# EAGLE schematic scematic (EAGLE 7.1.0)
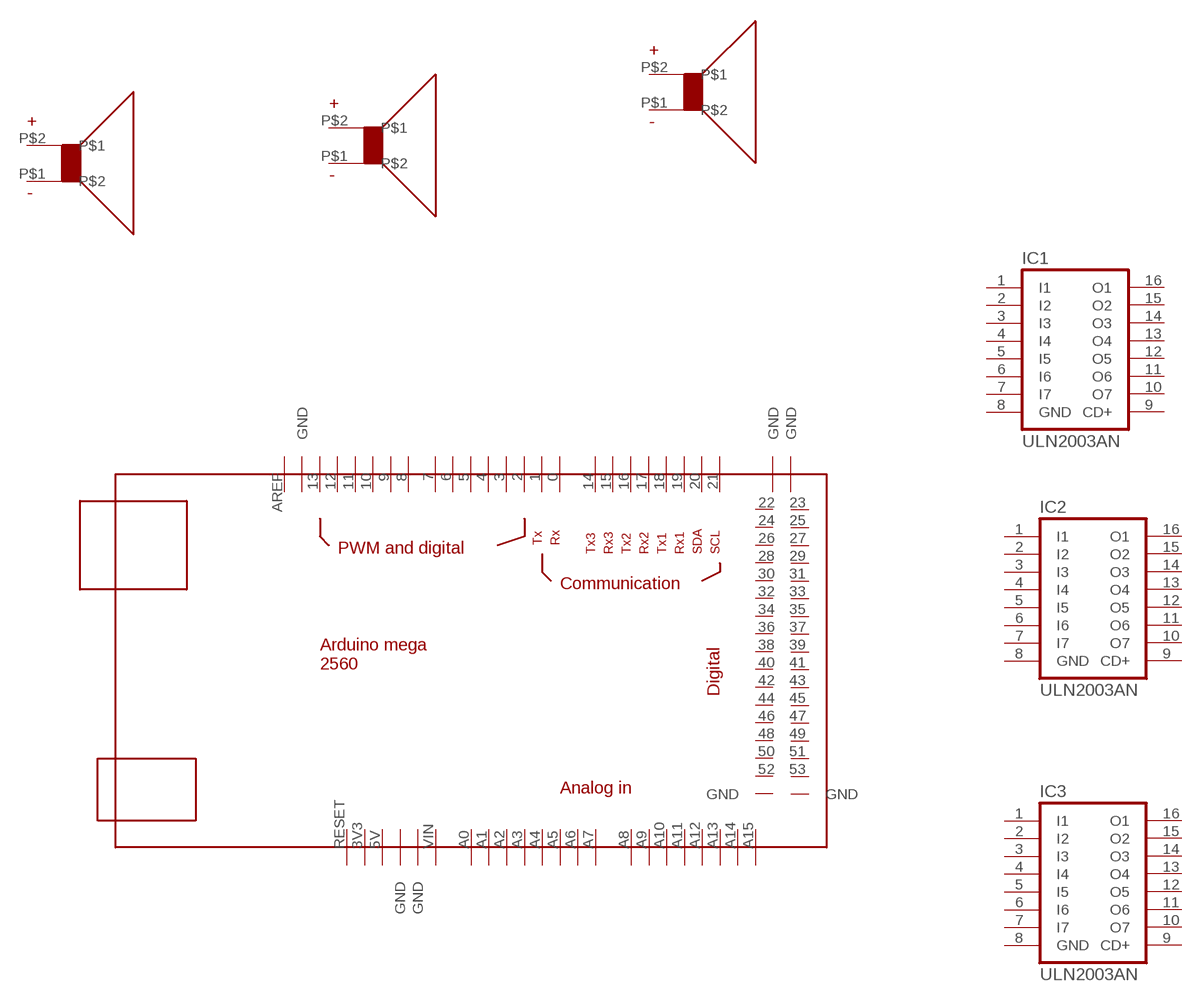
[diagram p0: schematic, sheet 1]

## Parts
IC1  ULN2003AN  [DIL16]
IC2  ULN2003AN  [DIL16]
IC3  ULN2003AN  [DIL16]
U$1  MEGA_DEVICE  [MEGABOX]
U$2  TRANSCEIVER  [TRANSCEIVER]
U$3  TRANSCEIVER  [TRANSCEIVER]
U$4  TRANSCEIVER  [TRANSCEIVER]
Unconnected: IC1.1(I1) IC1.2(I2) IC1.3(I3) IC1.4(I4) IC1.5(I5) IC1.6(I6) IC1.7(I7) IC1.9(CD+) IC1.10(O7) IC1.11(O6) IC1.12(O5) IC1.13(O4) IC1.14(O3) IC1.15(O2) IC1.16(O1) IC2.1(I1) IC2.2(I2) IC2.3(I3) IC2.4(I4) IC2.5(I5) IC2.6(I6) IC2.7(I7) IC2.9(CD+) IC2.10(O7) IC2.11(O6) IC2.12(O5) IC2.13(O4) IC2.14(O3) IC2.15(O2) IC2.16(O1) IC3.1(I1) IC3.2(I2) IC3.3(I3) IC3.4(I4) IC3.5(I5) IC3.6(I6) IC3.7(I7) IC3.9(CD+) IC3.10(O7) IC3.11(O6) IC3.12(O5) IC3.13(O4) IC3.14(O3) IC3.15(O2) IC3.16(O1) U$1.0 U$1.1 U$1.2 U$1.3 U$1.3V3 U$1.4 U$1.5 U$1.5V U$1.6 U$1.7 U$1.8 U$1.9 U$1.10 U$1.11 U$1.12 U$1.13 U$1.14 U$1.15 U$1.16 U$1.17 U$1.18 U$1.19 U$1.20 U$1.21 U$1.22 U$1.23 U$1.24 U$1.25 U$1.26 U$1.27 U$1.28 U$1.29 U$1.30 U$1.31 U$1.32 U$1.33 U$1.34 U$1.35 U$1.36 U$1.37 U$1.38 U$1.39 U$1.40 U$1.41 U$1.42 U$1.43 U$1.44 U$1.45 U$1.46 U$1.47 U$1.48 U$1.49 U$1.50 U$1.51 U$1.52 U$1.53 U$1.A0 U$1.A1 U$1.A2 U$1.A3 U$1.A4 U$1.A5 U$1.A6 U$1.A7 U$1.A8 U$1.A9 U$1.A10 U$1.A11 U$1.A12 U$1.A13 U$1.A14 U$1.A15 U$1.AREF U$1.GND@1(GND) U$1.GND@2(GND) U$1.GND@3(GND) U$1.GND@4(GND) U$1.GND@5(GND) U$1.GND@6(GND) U$1.GND@7(GND) U$1.RESET U$1.VIN U$2.P$1 U$2.P$2 U$3.P$1 U$3.P$2 U$4.P$1 U$4.P$2

## Power pins joined to a net without a drawn wire
GND: IC1.8(GND) IC2.8(GND) IC3.8(GND)

## Library data of the parts
IC1-IC3 = uln-udn:ULN2003A: DRIVER ARRAY
U$1 = ArduinoMegaSymbol:MEGA_DEVICE: mega card as device
U$2-U$4 = ultrasonic_transducer:TRANSCEIVER